# EAGLE design power_injector_rev_a (EAGLE 6.6.0)
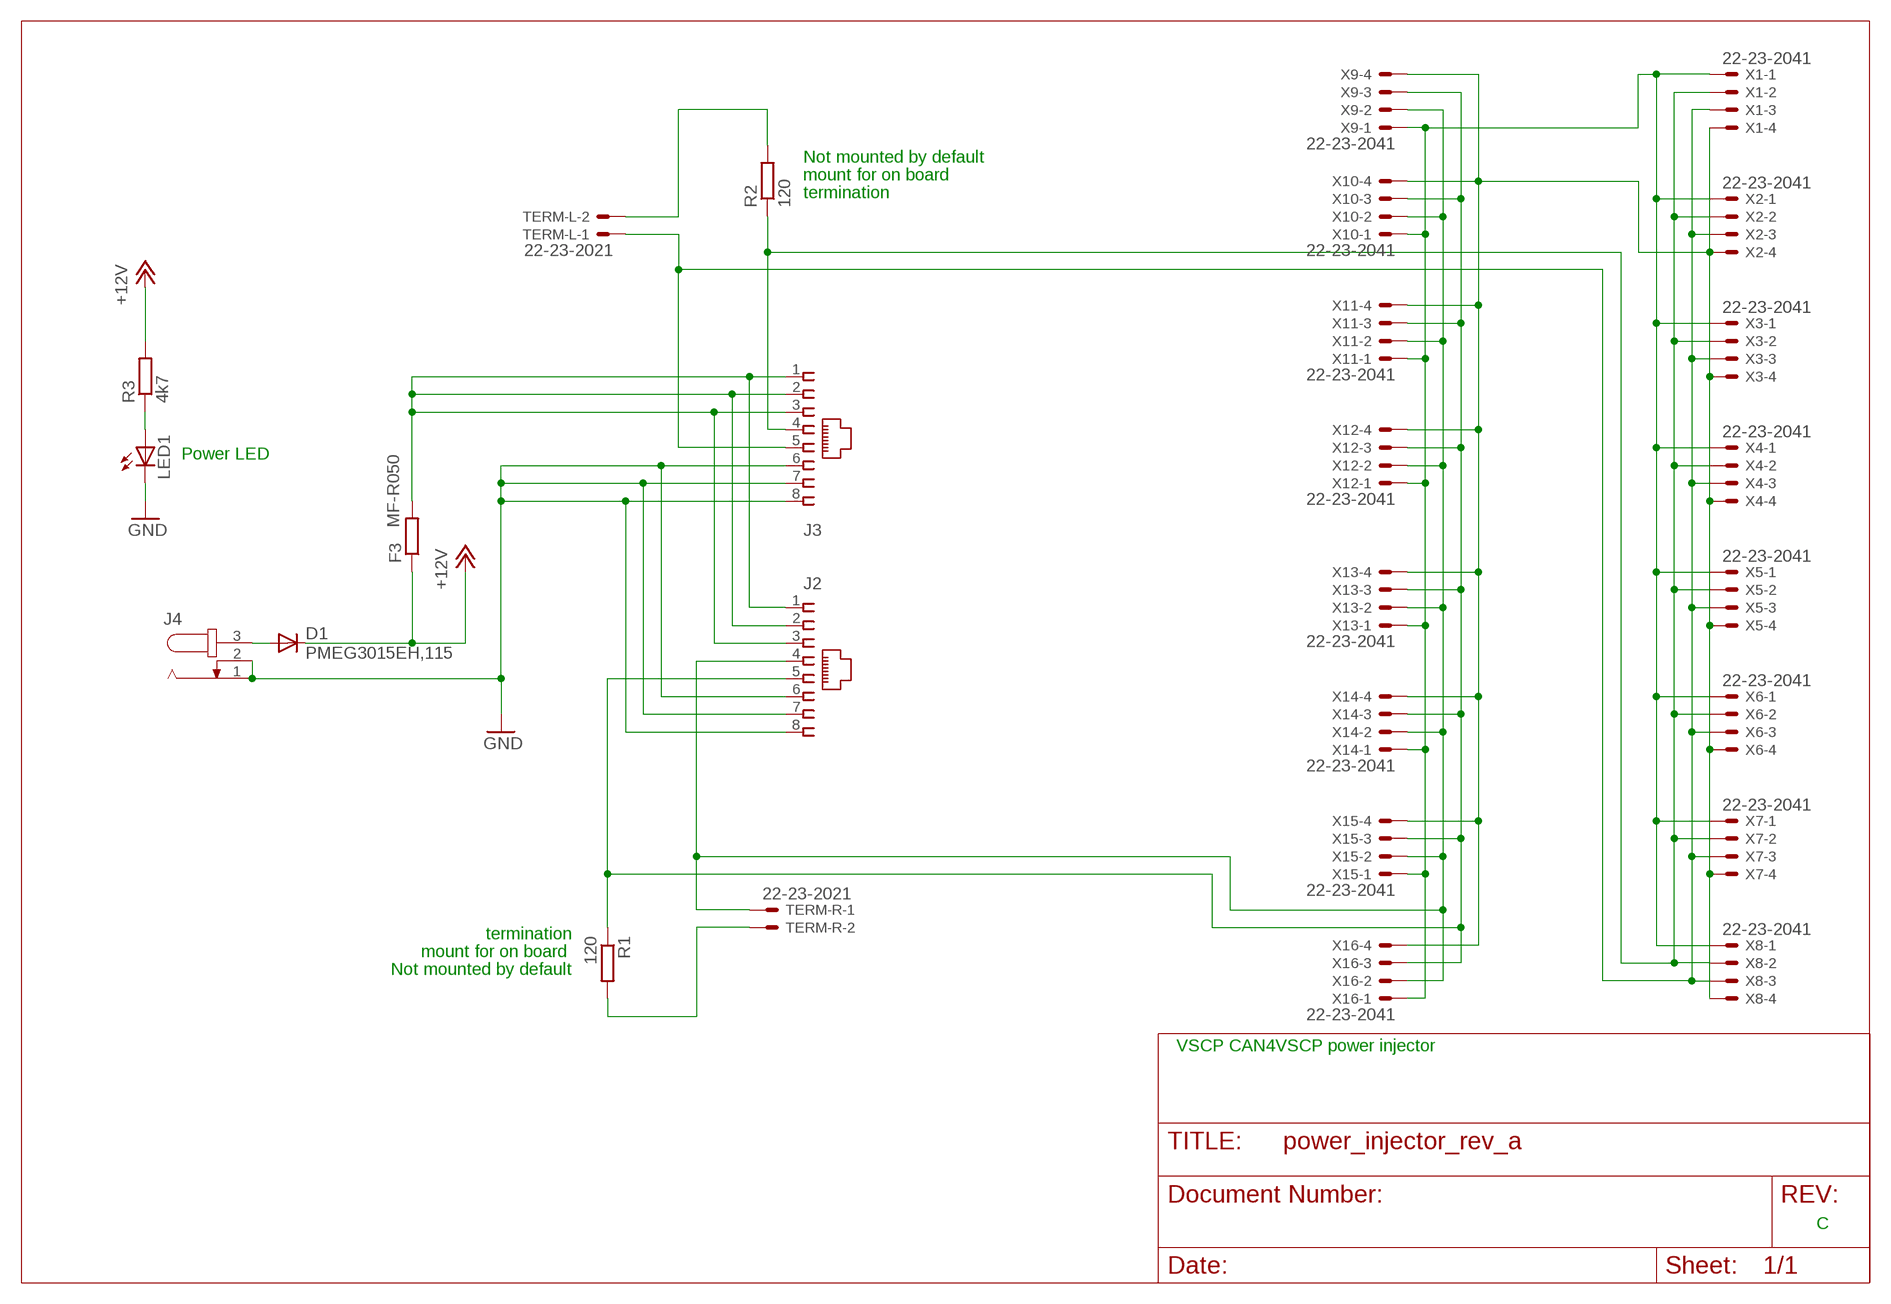
[diagram p0: schematic, sheet 1]

## Parts
D1  PMEG3015EH,115  DIODE-SMB  [SMB]
F3  MF-R050  R-EU_0204/5  [0204/5]
J2  A00-108-220-450  [RJ-45]
J3  A00-108-220-450  [RJ-45]
J4  JACK-PLUG0  [SPC4077]
LED1  LEDCHIP-LED0805  [CHIP-LED0805]
R1  120  R-EU_R0805  [R0805]
R2  120  R-EU_R0805  [R0805]
R3  4k7  R-EU_R0805  [R0805]
TERM-L  22-23-2021  [22-23-2021]
TERM-R  22-23-2021  [22-23-2021]
X1  22-23-2041  [22-23-2041]
X2  22-23-2041  [22-23-2041]
X3  22-23-2041  [22-23-2041]
X4  22-23-2041  [22-23-2041]
X5  22-23-2041  [22-23-2041]
X6  22-23-2041  [22-23-2041]
X7  22-23-2041  [22-23-2041]
X8  22-23-2041  [22-23-2041]
X9  22-23-2041  [22-23-2041]
X10  22-23-2041  [22-23-2041]
X11  22-23-2041  [22-23-2041]
X12  22-23-2041  [22-23-2041]
X13  22-23-2041  [22-23-2041]
X14  22-23-2041  [22-23-2041]
X15  22-23-2041  [22-23-2041]
X16  22-23-2041  [22-23-2041]

## Nets
+12V: D1.C F3.1 R3.2
CANH: J2.4 J3.4 R2.1 TERM-R.1 X1.2 X2.2 X3.2 X4.2 X5.2 X6.2 X7.2 X8.2 X9.2 X10.2 X11.2 X12.2 X13.2 X14.2 X15.2 X16.2
CANL: J2.5 J3.5 R1.1 TERM-L.1 X1.3 X2.3 X3.3 X4.3 X5.3 X6.3 X7.3 X8.3 X9.3 X10.3 X11.3 X12.3 X13.3 X14.3 X15.3 X16.3
GND: J2.6 J2.7 J2.8 J3.6 J3.7 J3.8 J4.1 J4.2 LED1.C X1.4 X2.4 X3.4 X4.4 X5.4 X6.4 X7.4 X8.4 X9.4 X10.4 X11.4 X12.4 X13.4 X14.4 X15.4 X16.4
N$2: LED1.A R3.1
N$3: R1.2 TERM-R.2
N$8: D1.A J4.3
N$11: R2.2 TERM-L.2
POWER: F3.2 J2.1 J2.2 J2.3 J3.1 J3.2 J3.3 X1.1 X2.1 X3.1 X4.1 X5.1 X6.1 X7.1 X8.1 X9.1 X10.1 X11.1 X12.1 X13.1 X14.1 X15.1 X16.1

## Notes on the sheet
- Not mounted by default
- mount for on board
- termination
- Power LED
- termination
- mount for on board
- Not mounted by default
- VSCP CAN4VSCP power injector
- C

## Library data of the parts
D1 = diode:DIODE-: DIODE
F3 R1-R3 = rcl:R-EU_: RESISTOR, European symbol
J2 J3 = vscpcan:A00-108-220-450
J4 = con-jack-special:JACK-PLUG: DC POWER JACK Power Jack, DC, Right Angle, Through Hole, Rated 5A at 16VDC, PC Terminals Distributor: Farnell (www.Farnell.de) Drawing: 84N1161.pdf / 84N1162.pdf Manufacturer: SPC Technology (www.spctechnology.com) Type: SPC4077 / SPC 4078; OC_FARNELL: unknown; OC_NEWARK: unknown
LED1 = led:LED: LED OSRAM: - CHIPLED LG R971, LG N971, LY N971, LG Q971, LY Q971, LO R971, LY R971 LH N974, LH R974 LS Q976, LO Q976, LY Q976 LO Q996 - Hyper CHIPLED LW Q18S LB Q993, LB Q99A, LB R99A - SideLED LS A670, LO A670, LY A670, LG A670, LP A670 LB A673, LV A673, LT A673, LW A673 LH A674 LY A675 LS A676, LA A676, LO A676, LY A676, LW A676 LS A679, LY A679, LG A679 - Hyper Micro SIDELED® LS Y876, LA Y876, LO Y876, LY Y876 LT Y87S - SmartLED LW L88C, LW L88S LB L89C, LB L89S, LG L890 LS L89K, LO L89K, LY L89K LS L896, LA L896, LO L896, LY L896 - TOPLED LS T670, LO T670, LY T670, LG T670, LP T670 LSG T670, LSP T670, LSY T670, LOP T670, LYG T670 LG T671, LOG T671, LSG T671 LB T673, LV T673, LT T673, LW T673 LH T674 LS T676, LA T676, LO T676, LY T676, LB T676, LH T676, LSB T676, LW T676 LB T67C, LV T67C, LT T67C, LS T67K, LO T67K, LY T67K, LW E67C LS E67B, LA E67B, LO E67B, LY E67B, LB E67C, LV E67C, LT E67C LW T67C LS T679, LY T679, LG T679 LS T770, LO T770, LY T770, LG T770, LP T770 LB T773, LV T773, LT T773, LW T773 LH T774 LS E675, LA E675, LY E675, LS T675 LS T776, LA T776, LO T776, LY T776, LB T776 LHGB T686 LT T68C, LB T68C - Hyper Mini TOPLED® LB M676 - Mini TOPLED Santana® LG M470 LS M47K, LO M47K, LY M47K Source: http://www.osram.convergy.de LUXEON: - LUMILED® LXK2-PW12-R00, LXK2-PW12-S00, LXK2-PW14-U00, LXK2-PW14-V00 LXK2-PM12-R00, LXK2-PM12-S00, LXK2-PM14-U00 LXK2-PE12-Q00, LXK2-PE12-R00, LXK2-PE12-S00, LXK2-PE14-T00, LXK2-PE14-U00 LXK2-PB12-K00, LXK2-PB12-L00, LXK2-PB12-M00, LXK2-PB14-N00, LXK2-PB14-P00, LXK2-PB14-Q00 LXK2-PR12-L00, LXK2-PR12-M00, LXK2-PR14-Q00, LXK2-PR14-R00 LXK2-PD12-Q00, LXK2-PD12-R00, LXK2-PD12-S00 LXK2-PH12-R00, LXK2-PH12-S00 LXK2-PL12-P00, LXK2-PL12-Q00, LXK2-PL12-R00 Source: www.luxeon.com KINGBRIGHT: KA-3528ASYC Source: www.kingbright.com
TERM-L TERM-R = con-molex:22-23-2021: .100" (2.54mm) Center Header - 2 Pin; MF: MOLEX; MPN: 22-23-2021; OC_FARNELL: 1462926; OC_NEWARK: 25C3832
X1-X16 = con-molex:22-23-2041: .100" (2.54mm) Center Header - 4 Pin; MF: MOLEX; MPN: 22-23-2041; OC_FARNELL: 1462920; OC_NEWARK: 38C0355

## Board
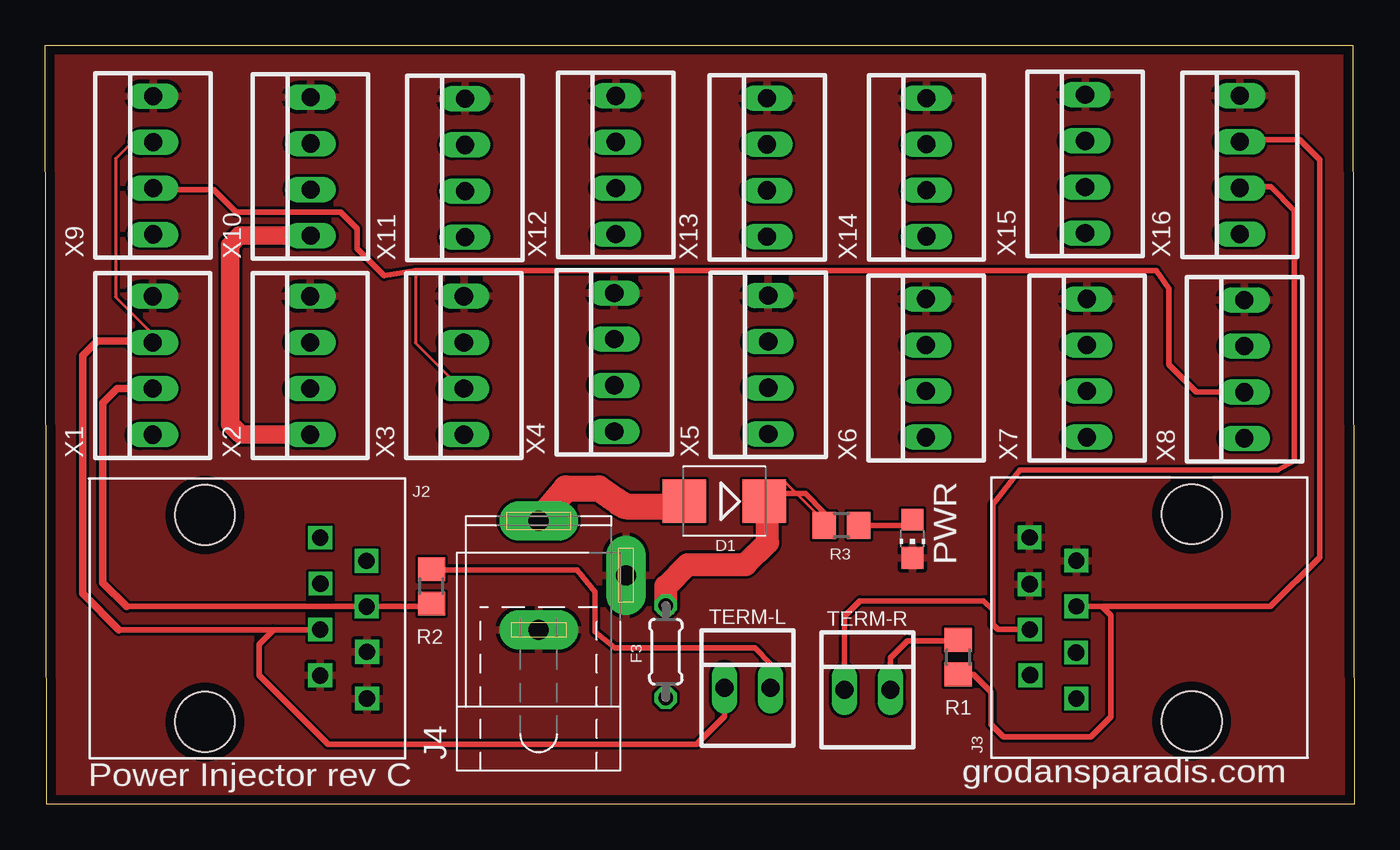
[diagram p1: board, top side]
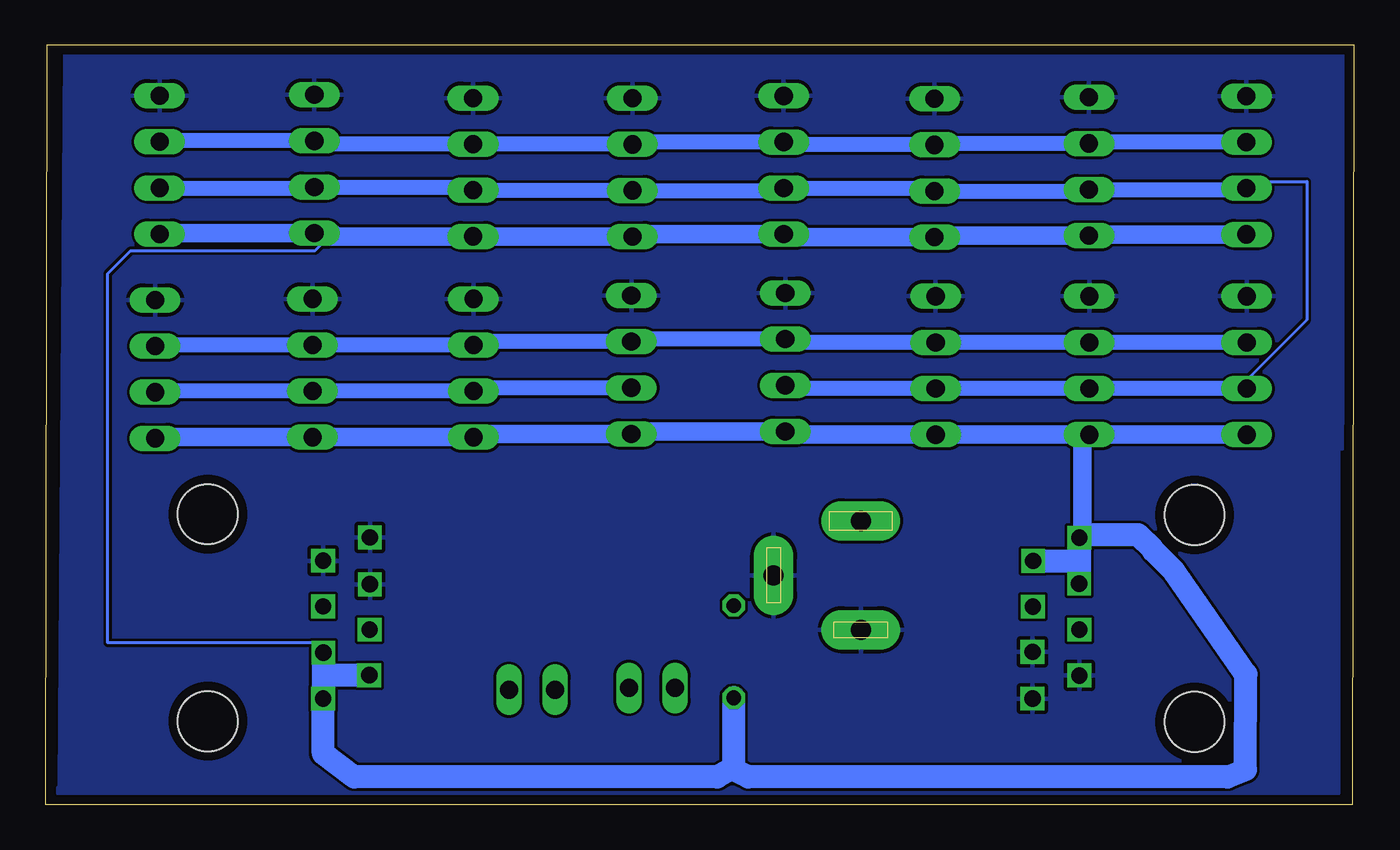
[diagram p2: board, bottom side, seen from below]

Size 72.06 x 41.79 mm. Coordinates in mm from the lower left corner, seen from the top.
Outline: 0.06,0 0,41.79 72,41.79 72.06,0 0.06,0
Copper layers (1*16): Top 0.035mm / dielectric 1.5mm / Bottom 0.035mm
Design rules "PCB-POOL": minimum track width 6mil, minimum drill 12mil, track to track 6mil, track to pad 6mil, pad to pad 6mil, via to via 6mil, smd to smd 6mil, copper to edge 20mil, drill to drill 8mil, minimum pad ring 8mil, minimum via ring 6mil, stop-mask expansion 3mil, vias tented up to drill 0mil, thermal gap 8mil

### Footprints (pad centres in the part's own frame; a part is rotated, then mirrored left to right if it is on the bottom)
SMB = smd 2.4 x 2.4: A 2.2,0; C -2.2,0
0204/5 = drill 0.813 octagon: 1 -2.54,0; 2 2.54,0
RJ-45 = drill 0.9 square: 1 -4.45,6.35; 2 -3.17,8.89; 3 -1.92,6.36; 4 -0.65,8.91; 5 0.62,6.35; 6 1.84,8.93; 7 3.14,6.35; 8 4.42,8.93 | hole 3.3: -5.7,0; 5.7,0
SPC4077 = drill 1.1 pad 2.184 long: 1 -3,0; 2 0,-4.8; 3 3,0
CHIP-LED0805 = smd 1.2 x 1.2: A 0,-1.05; C 0,1.05
R0805 = smd 1.3 x 1.5: 1 -0.95,0; 2 0.95,0
22-23-2021 = drill 1 long: 1 -1.27,0; 2 1.27,0
22-23-2041 = drill 1 long: 1 -3.81,0; 2 -1.27,0; 3 1.27,0; 4 3.81,0

### Placement (x,y rotation side)
D1  37.38,16.68 180 top
F3  34.16,8.4 270 top
J2  8.78,10.23 270 top
J3  63.12,10.27 90 top
J4  27.16,12.6 90 top
LED1  47.74,14.62 180 top
R1  50.26,8.1 90 top
R2  21.26,12 90 top
R3  43.83,15.35 180 top
TERM-L  38.66,6.4 0 top
TERM-R  45.26,6.3 0 top
X1  5.91,24.16 90 top
X2  14.58,24.16 90 top
X3  23.04,24.16 90 top
X4  31.32,24.34 90 top
X5  39.8,24.2 90 top
X6  48.49,24.02 90 top
X7  57.35,24.02 90 top
X8  66.02,23.96 90 top
X9  5.93,35.19 90 top
X10  14.6,35.12 90 top
X11  23.1,35.04 90 top
X12  31.41,35.2 90 top
X13  39.74,35.07 90 top
X14  48.51,35.08 90 top
X15  57.25,35.26 90 top
X16  65.77,35.21 90 top

### Tracks (layer width: path | path; a pad name or v marks a point on that pad's centre or on a via)
+12V
  Top 0.152: R3.2 43.24,15.24 40.7,17.78 D1.C
  Top 0.305: R3.2 42.88,16.08 41.86,17.1 40,17.1
  Top 1.27: F3.1 34.16,12 35.36,13.2 38.56,13.2 39.76,14.4 39.76,16.5 D1.C
CANH
  Top 0.152: 20.38,29.4 20.38,25.4 22.92,22.86 X3.2
  Top 0.305: X8.2 63.37,22.69 61.86,24.2 61.86,28.4 61.16,29.4 20.38,29.4 18.66,29.1 17.16,30.6 17.16,31.7 16.26,32.6 10.51,32.6 9.26,33.85 6,33.85 | 52.16,10.7 52.16,9.9 52.44,9.62 J3.4 | 52.16,10.7 52.16,16.5 53.66,18.4 67.86,18.4 68.76,18.9 68.76,32.7 67.46,34 65.32,34 65.26,33.94 X16.2 | 4.48,10.88 J2.4 21.09,10.88 R2.1 | TERM-R.1 43.99,10.33 44.86,11.2 51.66,11.2 52.16,10.7
  Top 0.406: 4.48,10.88 3.16,12.2 3.16,22.1 3.96,22.9 X1.2
  Bottom 0.152: X1.2 6.41,22.86 2.6,26.67 2.6,34.29 5.14,34.29 X9.2
  Bottom 0.406: X14.2
  Bottom 0.813: X1.2 X2.2 X3.2 31.32,22.89 X4.2 | X5.2 48.49,22.93 X6.2 X7.2 66.02,22.75 X8.2 | X16.2 57.25,33.94 X15.2 48.51,33.99 X14.2 | X9.2 5.93,33.85 X10.2 14.6,33.77 X11.2 23.1,33.93 X12.2 31.41,33.8 X13.2 X14.2
CANL
  Top 0.152: X1.3 6.41,25.4 3.87,27.94 3.87,35.56 5.14,36.83 X9.3
  Top 0.305: X16.3 65.89,36.6 69.06,36.6 70.16,35.5 70.16,13.6 67.45,10.89 J3.5 58.16,10.9 58.66,10.4 58.66,4.8 57.56,3.7 52.76,3.7 52.06,4.4 52.06,6.2 51.11,7.15 R1.1 | 4.05,9.61 12.56,9.61 | 12.56,9.61 J2.5 | TERM-L.1 37.39,4.83 35.86,3.3 15.56,3.3 11.76,7.1 11.76,8.81 12.56,9.61
  Top 0.406: 4.05,9.61 2.06,11.6 2.06,24.7 2.86,25.5 5.84,25.5 X1.3
  Bottom 0.813: X1.3 X2.3 X3.3 31.32,25.43 X4.3 39.8,25.61 X5.3 48.49,25.47 X6.3 X7.3 66.02,25.29 X8.3 | X9.3 14.6,36.46 X10.3 23.1,36.39 X11.3 31.41,36.31 X12.3 39.74,36.47 X13.3 X14.3 57.25,36.35 X15.3 65.77,36.53 X16.3
GND
  pour Bottom: 0.66,19.6 0.86,19.6 0.86,0.6 71.36,0.6 71.36,0.9 71.26,0.9 70.96,41.39 0.66,41.39
  pour Top: 0.46,41.29 0.46,0.4 0.66,0.2 71.26,0.2 71.86,0.8 71.86,19.4 71.26,41.39
N$2
  Top 0.305: R3.1 47.42,15.35 LED1.A
N$3
  Top 0.305: TERM-R.2 46.53,8.07 47.46,9 50.21,9 R1.2
N$8
  Top 1.422: J4.3 28.66,17.4 30.46,17.4 31.46,16.7 31.96,16.4 34.9,16.4 D1.A
N$11
  Top 0.305: TERM-L.2 39.93,7.73 39.06,8.6 31.36,8.6 30.26,9.5 30.26,11.7 29.26,12.9 21.31,12.9 R2.2
POWER
  Top 1.016: X2.1 10.76,20.35 10.16,20.95 10.16,30.8 10.66,31.3 X10.1
  Bottom 0.152: J2.1 15.3,15.24 14.97,14.84 | X15.1 55.94,31.75 57.21,30.48 67.37,30.48 68.64,29.21 68.64,8.89 57.21,8.89 J3.3
  Bottom 0.813: 9.91,12.85 9.94,12.85 | 11.06,13.97 11.06,14.02 | J3.1 | 56.76,7.1 J3.3
  Bottom 1.016: 14.53,31.38 X10.1 15.46,31.31 | 15.46,31.31 23.02,31.31 X11.1 31.25,31.23 X12.1 39.61,31.39 X13.1 X14.1 57.07,31.27 X15.1 65.72,31.45 X16.1 | X1.1 X2.1 | X2.1 X3.1 31.14,20.35 X4.1 39.66,20.53 X5.1 48.31,20.39 X6.1 X7.1 65.96,20.21 X8.1 | 14.97,14.84 14.97,19.96 X2.1 | X9.1 15.39,31.38 15.46,31.31
  Bottom 1.27: 34.16,1.9 33.36,1.5 6.96,1.5 5.98,1.9 5.96,7.16 9.91,12.85 | 9.94,12.85 11.06,13.97 | 11.06,14.02 11.88,14.84 14.97,14.84 | F3.2 34.16,2 35.06,1.5 55.06,1.5 56.76,2.8 J3.1 | J3.2 56.76,7.1 | J3.3 J3.1 | J2.1 J2.3 15.14,13.4 J2.2

### Text on the board
tNames: PWR | Power Injector rev C | grodansparadis.com